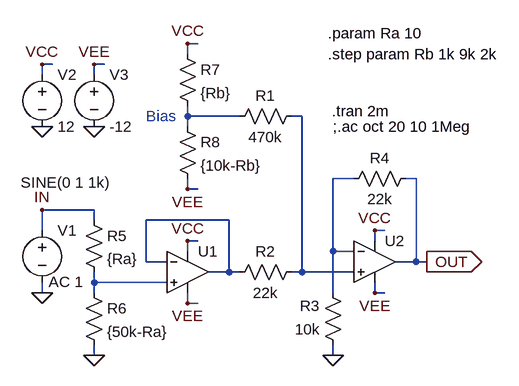
[diagram p0: schematic CV_Amp.asc]
CV_Amp.asc, the LTspice schematic file:
Version 4
SHEET 1 880 680
WIRE 176 -192 160 -192
WIRE 160 -176 160 -192
WIRE -48 -160 -64 -160
WIRE 32 -160 16 -160
WIRE -64 -144 -64 -160
WIRE 16 -144 16 -160
WIRE 160 -80 160 -96
WIRE 240 -80 160 -80
WIRE 336 -80 320 -80
WIRE 160 -64 160 -80
WIRE 416 16 384 16
WIRE 512 16 496 16
WIRE 160 32 160 16
WIRE 176 32 160 32
WIRE 16 64 -64 64
WIRE 16 80 16 64
WIRE 224 80 96 80
WIRE -64 96 -64 64
WIRE 464 96 448 96
WIRE 176 112 160 112
WIRE 448 112 448 96
WIRE 160 128 160 112
WIRE 384 128 384 16
WIRE 416 128 384 128
WIRE 96 144 96 80
WIRE 128 144 96 144
WIRE 512 144 512 16
WIRE 512 144 480 144
WIRE 528 144 512 144
WIRE 224 160 224 80
WIRE 224 160 192 160
WIRE 240 160 224 160
WIRE 336 160 336 -80
WIRE 336 160 320 160
WIRE 416 160 336 160
WIRE 16 176 16 160
WIRE 128 176 16 176
WIRE -64 192 -64 176
WIRE 16 192 16 176
WIRE 384 192 384 128
WIRE 448 192 448 176
WIRE 464 192 448 192
WIRE 160 208 160 192
WIRE 176 208 160 208
WIRE 16 288 16 272
WIRE 384 288 384 272
FLAG 448 96 VCC
FLAG 448 192 VEE
FLAG 160 112 VCC
FLAG 160 208 VEE
FLAG 16 288 0
FLAG 160 -192 VCC
FLAG 160 32 VEE
FLAG -64 192 0
FLAG 384 288 0
FLAG 528 144 OUT
IOPIN 528 144 Out
FLAG -64 64 IN
FLAG -64 -64 0
FLAG 16 -64 0
FLAG -64 -160 VCC
FLAG 16 -160 VEE
SYMBOL Opamps\\UniversalOpamp2 160 160 R0
SYMATTR InstName U1
SYMBOL res 336 -96 R90
WINDOW 0 0 56 VBottom 2
WINDOW 3 32 56 VTop 2
SYMATTR InstName R1
SYMATTR Value 470k
SYMBOL res 336 144 R90
WINDOW 0 0 56 VBottom 2
WINDOW 3 32 56 VTop 2
SYMATTR InstName R2
SYMATTR Value 22k
SYMBOL Opamps\\UniversalOpamp2 448 144 R0
SYMATTR InstName U2
SYMBOL res 400 288 R180
WINDOW 0 36 76 Left 2
WINDOW 3 36 40 Left 2
SYMATTR InstName R3
SYMATTR Value 10k
SYMBOL res 512 0 R90
WINDOW 0 0 56 VBottom 2
WINDOW 3 32 56 VTop 2
SYMATTR InstName R4
SYMATTR Value 22k
SYMBOL res 0 64 R0
SYMATTR InstName R5
SYMATTR Value {Ra}
SYMBOL res 0 176 R0
SYMATTR InstName R6
SYMATTR Value {50k-Ra}
SYMBOL res 144 -192 R0
SYMATTR InstName R7
SYMATTR Value {Rb}
SYMBOL res 144 -80 R0
SYMATTR InstName R8
SYMATTR Value {10k-Rb}
SYMBOL voltage -64 80 R0
WINDOW 3 -33 -58 Left 2
WINDOW 123 10 95 Left 2
WINDOW 39 0 0 Left 0
SYMATTR InstName V1
SYMATTR Value SINE(0 1 1k)
SYMATTR Value2 AC 1
SYMBOL voltage -64 -160 R0
WINDOW 123 0 0 Left 0
WINDOW 39 0 0 Left 0
SYMATTR InstName V2
SYMATTR Value 12
SYMBOL voltage 16 -160 R0
WINDOW 123 0 0 Left 0
WINDOW 39 0 0 Left 0
SYMATTR InstName V3
SYMATTR Value -12
TEXT 376 -208 Left 2 !.param Ra 10
TEXT 376 -176 Left 2 !.step param Rb 1k 9k 2k
TEXT 96 -80 Left 2 ;Bias
TEXT 382 -88 Left 2 !.tran 2m
TEXT 384 -64 Left 2 !;.ac oct 20 10 1Meg

The netlist it stands for:
* CV_Amp.asc
XU1 N005 N004 VCC VEE N004 level.2 Avol=1Meg GBW=10Meg Slew=10Meg ilimit=25m rail=0 Vos=0 phimargin=45 en=0 enk=0 in=0 ink=0 Rin=500Meg  ; pins IN+ IN- V+ V- OUT
R1 N002 N001 470k
R2 N002 N004 22k
XU2 N002 N003 VCC VEE OUT level.2 Avol=1Meg GBW=10Meg Slew=10Meg ilimit=25m rail=0 Vos=0 phimargin=45 en=0 enk=0 in=0 ink=0 Rin=500Meg  ; pins IN+ IN- V+ V- OUT
R3 0 N003 10k
R4 OUT N003 22k
R5 IN N005 {Ra}
R6 N005 0 {50k-Ra}
R7 VCC N001 {Rb}
R8 N001 VEE {10k-Rb}
V1 IN 0 SINE(0 1 1k) AC 1
V2 VCC 0 12
V3 VEE 0 -12
.param Ra 10
.step param Rb 1k 9k 2k
* Bias
.tran 2m
;.ac oct 20 10 1Meg
.lib UniversalOpamps2.sub
.backanno
.end